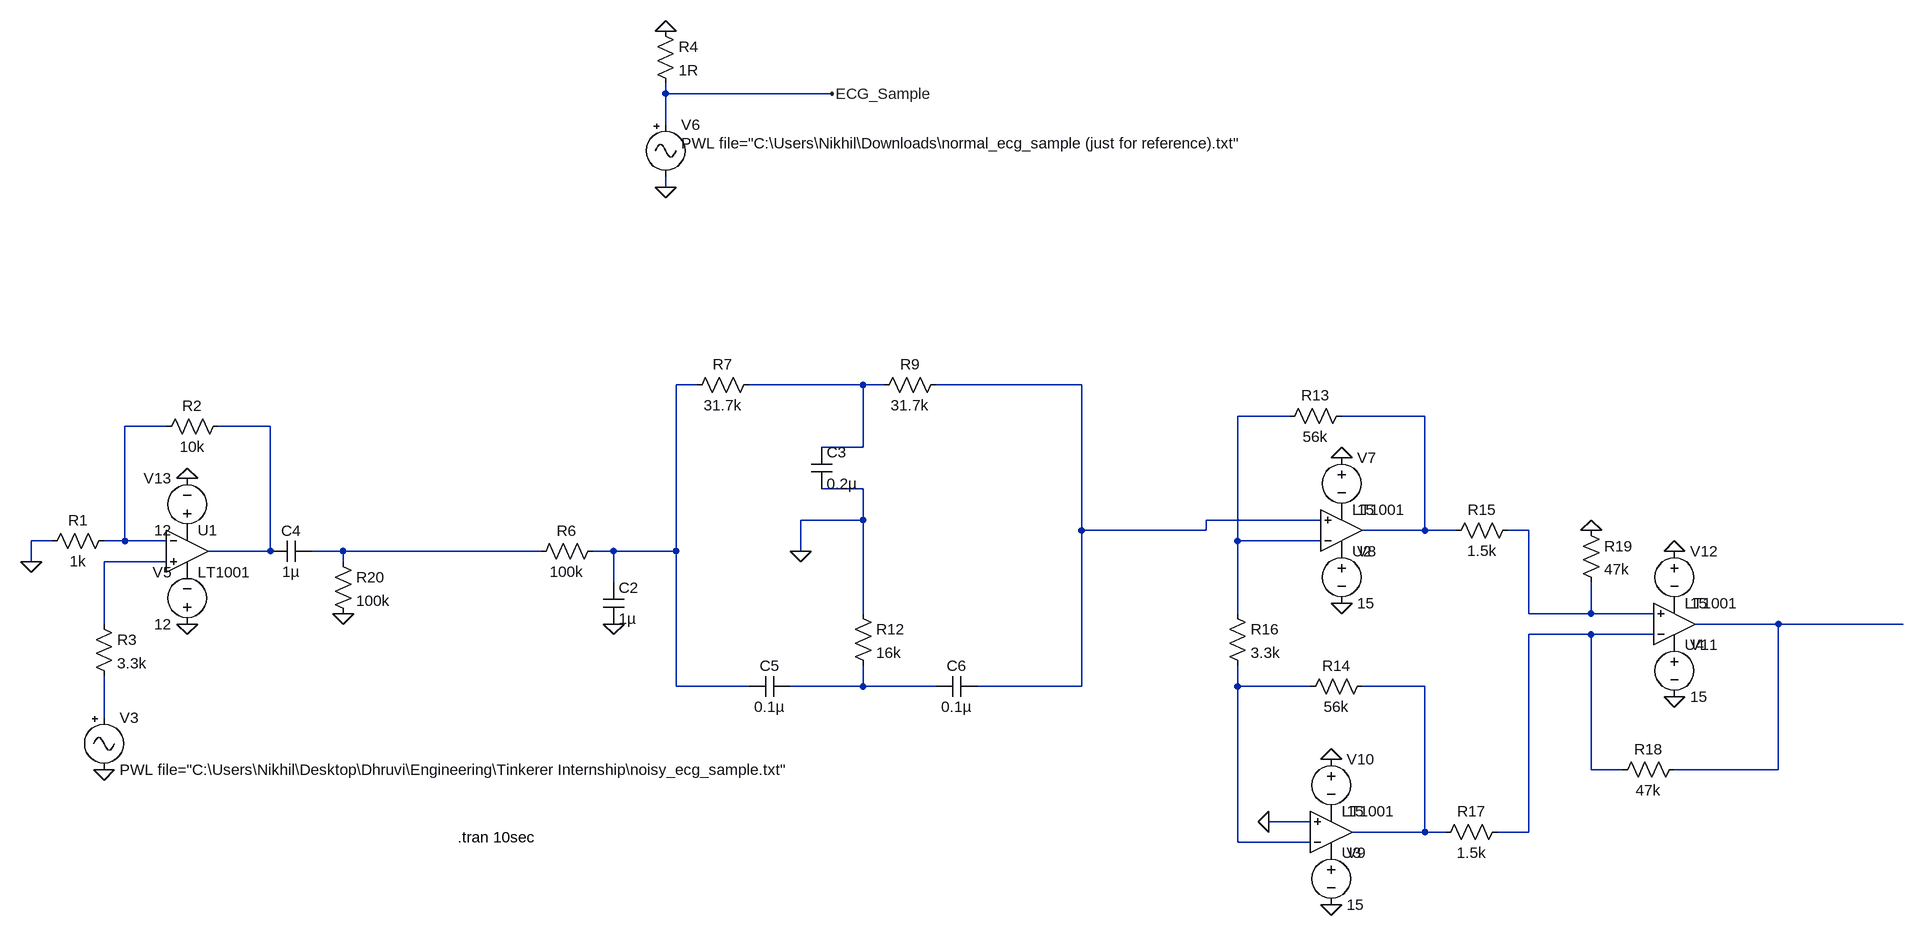
[diagram p0: schematic ECG Signal Processing.asc]
ECG Signal Processing.asc, the LTspice schematic file:
Version 4
SHEET 1 2820 996
WIRE 256 -576 256 -592
WIRE 512 -576 256 -576
WIRE 256 -528 256 -576
WIRE 256 -432 256 -448
WIRE 304 -128 272 -128
WIRE 560 -128 384 -128
WIRE 592 -128 560 -128
WIRE 896 -128 672 -128
WIRE 1216 -80 1136 -80
WIRE 1424 -80 1296 -80
WIRE -512 -64 -576 -64
WIRE -352 -64 -432 -64
WIRE 560 -32 560 -128
WIRE 560 -32 496 -32
WIRE 560 32 496 32
WIRE 560 80 560 32
WIRE 560 80 464 80
WIRE 1264 80 1088 80
WIRE 896 96 896 -128
WIRE 1088 96 1088 80
WIRE 1088 96 896 96
WIRE 1424 96 1424 -80
WIRE 1424 96 1328 96
WIRE 1472 96 1424 96
WIRE 1584 96 1552 96
WIRE -688 112 -720 112
WIRE -576 112 -576 -64
WIRE -576 112 -608 112
WIRE -512 112 -576 112
WIRE 1136 112 1136 -80
WIRE 1264 112 1136 112
WIRE -352 128 -352 -64
WIRE -352 128 -448 128
WIRE -240 128 -288 128
WIRE 64 128 -240 128
WIRE 176 128 144 128
WIRE 272 128 272 -128
WIRE 272 128 176 128
WIRE 464 128 464 80
WIRE -720 144 -720 112
WIRE -512 144 -608 144
WIRE -240 144 -240 128
WIRE 176 176 176 128
WIRE 560 224 560 80
WIRE 1136 224 1136 112
WIRE 1584 224 1584 96
WIRE 1680 224 1680 176
WIRE 1680 224 1584 224
WIRE 1776 224 1680 224
WIRE -608 240 -608 144
WIRE 1968 240 1840 240
WIRE 2160 240 1968 240
WIRE 1680 256 1584 256
WIRE 1776 256 1680 256
WIRE 272 336 272 128
WIRE 384 336 272 336
WIRE 560 336 560 304
WIRE 560 336 448 336
WIRE 672 336 560 336
WIRE 896 336 896 96
WIRE 896 336 736 336
WIRE 1136 336 1136 304
WIRE 1248 336 1136 336
WIRE 1424 336 1328 336
WIRE -608 384 -608 320
WIRE 1680 464 1680 256
WIRE 1728 464 1680 464
WIRE 1968 464 1968 240
WIRE 1968 464 1808 464
WIRE 1248 544 1184 544
WIRE 1424 560 1424 336
WIRE 1424 560 1312 560
WIRE 1456 560 1424 560
WIRE 1584 560 1584 256
WIRE 1584 560 1536 560
WIRE 1136 576 1136 336
WIRE 1248 576 1136 576
FLAG -608 464 0
FLAG -720 144 0
FLAG -480 240 0
FLAG 256 -432 0
FLAG 256 -672 0
FLAG 512 -576 ECG_Sample
FLAG 176 240 0
FLAG 464 128 0
FLAG 1296 -16 0
FLAG 1296 208 0
FLAG 1280 672 0
FLAG 1280 448 0
FLAG 1184 544 0
FLAG 1808 352 0
FLAG 1808 128 0
FLAG 1680 96 0
FLAG -480 16 0
FLAG -240 224 0
SYMBOL Misc\\signal -608 368 R0
WINDOW 123 24 44 Left 2
WINDOW 39 0 0 Left 0
SYMATTR InstName V3
SYMATTR Value PWL file="C:\Users\Nikhil\Desktop\Dhruvi\Engineering\Tinkerer Internship\noisy_ecg_sample.txt"
SYMBOL OpAmps\\LT1001 -480 64 R0
SYMATTR InstName U1
SYMBOL voltage -480 256 R180
WINDOW 0 24 96 Left 2
WINDOW 3 24 16 Left 2
WINDOW 123 0 0 Left 0
WINDOW 39 0 0 Left 0
SYMATTR InstName V5
SYMATTR Value 12
SYMBOL res -592 96 R90
WINDOW 0 0 56 VBottom 2
WINDOW 3 32 56 VTop 2
SYMATTR InstName R1
SYMATTR Value 1k
SYMBOL res -416 -80 R90
WINDOW 0 0 56 VBottom 2
WINDOW 3 32 56 VTop 2
SYMATTR InstName R2
SYMATTR Value 10k
SYMBOL res -624 224 R0
SYMATTR InstName R3
SYMATTR Value 3.3k
SYMBOL Misc\\signal 256 -544 R0
WINDOW 123 0 0 Left 0
WINDOW 39 0 0 Left 0
WINDOW 3 24 44 Left 2
SYMATTR Value PWL file="C:\Users\Nikhil\Downloads\normal_ecg_sample (just for reference).txt"
SYMATTR InstName V6
SYMBOL res 240 -688 R0
SYMATTR InstName R4
SYMATTR Value 1R
SYMBOL res 160 112 R90
WINDOW 0 0 56 VBottom 2
WINDOW 3 32 56 VTop 2
SYMATTR InstName R6
SYMATTR Value 100k
SYMBOL cap 160 176 R0
SYMATTR InstName C2
SYMATTR Value 1µ
SYMBOL res 400 -144 R90
WINDOW 0 0 56 VBottom 2
WINDOW 3 32 56 VTop 2
SYMATTR InstName R7
SYMATTR Value 31.7k
SYMBOL res 688 -144 R90
WINDOW 0 0 56 VBottom 2
WINDOW 3 32 56 VTop 2
SYMATTR InstName R9
SYMATTR Value 31.7k
SYMBOL cap 480 -32 R0
SYMATTR InstName C3
SYMATTR Value 0.2µ
SYMBOL res 544 208 R0
SYMATTR InstName R12
SYMATTR Value 16k
SYMBOL cap 448 320 R90
WINDOW 0 0 32 VBottom 2
WINDOW 3 32 32 VTop 2
SYMATTR InstName C5
SYMATTR Value 0.1µ
SYMBOL cap 736 320 R90
WINDOW 0 0 32 VBottom 2
WINDOW 3 32 32 VTop 2
SYMATTR InstName C6
SYMATTR Value 0.1µ
SYMBOL OpAmps\\LT1001 1296 160 M180
SYMATTR InstName U2
SYMBOL voltage 1296 -32 R0
WINDOW 123 0 0 Left 0
WINDOW 39 0 0 Left 0
SYMATTR InstName V7
SYMATTR Value 15
SYMBOL voltage 1296 112 R0
WINDOW 123 0 0 Left 0
WINDOW 39 0 0 Left 0
SYMATTR InstName V8
SYMATTR Value 15
SYMBOL res 1312 -96 R90
WINDOW 0 0 56 VBottom 2
WINDOW 3 32 56 VTop 2
SYMATTR InstName R13
SYMATTR Value 56k
SYMBOL res 1344 320 R90
WINDOW 0 0 56 VBottom 2
WINDOW 3 32 56 VTop 2
SYMATTR InstName R14
SYMATTR Value 56k
SYMBOL res 1568 80 R90
WINDOW 0 0 56 VBottom 2
WINDOW 3 32 56 VTop 2
SYMATTR InstName R15
SYMATTR Value 1.5k
SYMBOL OpAmps\\LT1001 1280 624 M180
SYMATTR InstName U3
SYMBOL voltage 1280 576 R0
WINDOW 123 0 0 Left 0
WINDOW 39 0 0 Left 0
SYMATTR InstName V9
SYMATTR Value 15
SYMBOL voltage 1280 432 R0
WINDOW 123 0 0 Left 0
WINDOW 39 0 0 Left 0
SYMATTR InstName V10
SYMATTR Value 15
SYMBOL res 1120 208 R0
SYMATTR InstName R16
SYMATTR Value 3.3k
SYMBOL res 1552 544 R90
WINDOW 0 0 56 VBottom 2
WINDOW 3 32 56 VTop 2
SYMATTR InstName R17
SYMATTR Value 1.5k
SYMBOL OpAmps\\LT1001 1808 304 M180
SYMATTR InstName U4
SYMBOL voltage 1808 256 R0
WINDOW 123 0 0 Left 0
WINDOW 39 0 0 Left 0
SYMATTR InstName V11
SYMATTR Value 15
SYMBOL voltage 1808 112 R0
WINDOW 123 0 0 Left 0
WINDOW 39 0 0 Left 0
SYMATTR InstName V12
SYMATTR Value 15
SYMBOL res 1824 448 R90
WINDOW 0 0 56 VBottom 2
WINDOW 3 32 56 VTop 2
SYMATTR InstName R18
SYMATTR Value 47k
SYMBOL res 1664 80 R0
SYMATTR InstName R19
SYMATTR Value 47k
SYMBOL voltage -480 112 R180
WINDOW 0 24 96 Left 2
WINDOW 3 24 16 Left 2
WINDOW 123 0 0 Left 0
WINDOW 39 0 0 Left 0
SYMATTR InstName V13
SYMATTR Value 12
SYMBOL cap -288 112 R90
WINDOW 0 0 32 VBottom 2
WINDOW 3 32 32 VTop 2
SYMATTR InstName C4
SYMATTR Value 1µ
SYMBOL res -256 128 R0
SYMATTR InstName R20
SYMATTR Value 100k
TEXT -64 568 Left 2 !.tran 10sec

The netlist it stands for:
* ECG Signal Processing.asc
V3 N016 0 PWL file="C:\Users\Nikhil\Desktop\Dhruvi\Engineering\Tinkerer Internship\noisy_ecg_sample.txt"
XU1 N010 N006 P001 P002 N007 LT1001  ; pins In+ In- V+ V- OUT
V5 0 P002 12
R1 N006 0 1k
R2 N007 N006 10k
R3 N010 N016 3.3k
V6 ECG_Sample 0 PWL file="C:\Users\Nikhil\Downloads\normal_ecg_sample (just for reference).txt"
R4 0 ECG_Sample 1R
R6 N001 N009 100k
C2 N001 0 1µ
R7 N002 N001 31.7k
R9 N003 N002 31.7k
C3 N002 0 0.2µ
R12 0 N013 16k
C5 N013 N001 0.1µ
C6 N003 N013 0.1µ
XU2 N003 N004 P003 P004 N005 LT1001  ; pins In+ In- V+ V- OUT
V7 0 P004 15
V8 P003 0 15
R13 N005 N004 56k
R14 N015 N014 56k
R15 N008 N005 1.5k
XU3 0 N014 P005 P006 N015 LT1001  ; pins In+ In- V+ V- OUT
V9 P005 0 15
V10 0 P006 15
R16 N004 N014 3.3k
R17 N012 N015 1.5k
XU4 N008 N012 P007 P008 N011 LT1001  ; pins In+ In- V+ V- OUT
V11 P007 0 15
V12 0 P008 15
R18 N011 N012 47k
R19 0 N008 47k
V13 P001 0 12
C4 N009 N007 1µ
R20 N009 0 100k
.tran 10sec
.lib LTC.lib
.backanno
.end